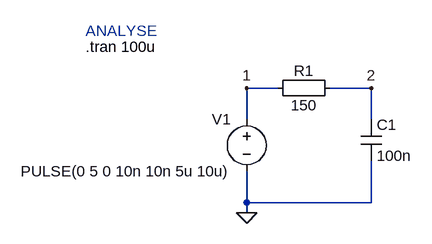
[diagram p0: schematic bsp133_reisch.asc]
bsp133_reisch.asc, the LTspice schematic file:
Version 4.1
SHEET 1 880 680
WIRE 80 80 32 80
WIRE 224 80 160 80
WIRE 32 128 32 80
WIRE 224 128 224 80
WIRE 32 256 32 208
WIRE 224 256 224 192
WIRE 224 256 32 256
WIRE 32 272 32 256
FLAG 32 272 0
FLAG 32 80 1
FLAG 224 80 2
SYMBOL cap 208 128 R0
SYMATTR InstName C1
SYMATTR Value 100n
SYMBOL EuropeanResistor 176 64 R90
WINDOW 0 5 56 VBottom 2
WINDOW 3 27 56 VTop 2
SYMATTR InstName R1
SYMATTR Value 150
SYMBOL voltage 32 112 M0
WINDOW 123 0 0 Left 0
WINDOW 39 0 0 Left 0
SYMATTR InstName V1
SYMATTR Value PULSE(0 5 0 10n 10n 5u 10u)
TEXT -216 16 Left 2 !.tran 100u
TEXT -216 -8 Left 2 ;ANALYSE

The netlist it stands for:
* bsp133_reisch.asc
C1 2 0 100n
R1 2 1 150
V1 1 0 PULSE(0 5 0 10n 10n 5u 10u)
.tran 100u
* ANALYSE
.backanno
.end

* Results of the author's LTspice run, read from the files saved beside the schematic
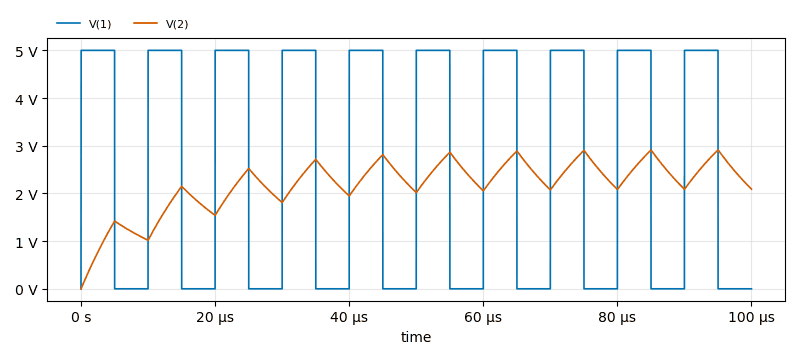
[diagram p1: Transient Analysis of bsp133_reisch.asc, plotted from the saved traces]
* Transient Analysis, 1 run:
*   V(1): min 0 V, max 5 V, average 2.505 V, rms 3.539 V, last 0 V
*   V(2): min 0 V, max 2.913 V, average 2.191 V, rms 2.256 V, last 2.09 V